# Altium schematic sheet SirenSchematic.SchDoc
size B
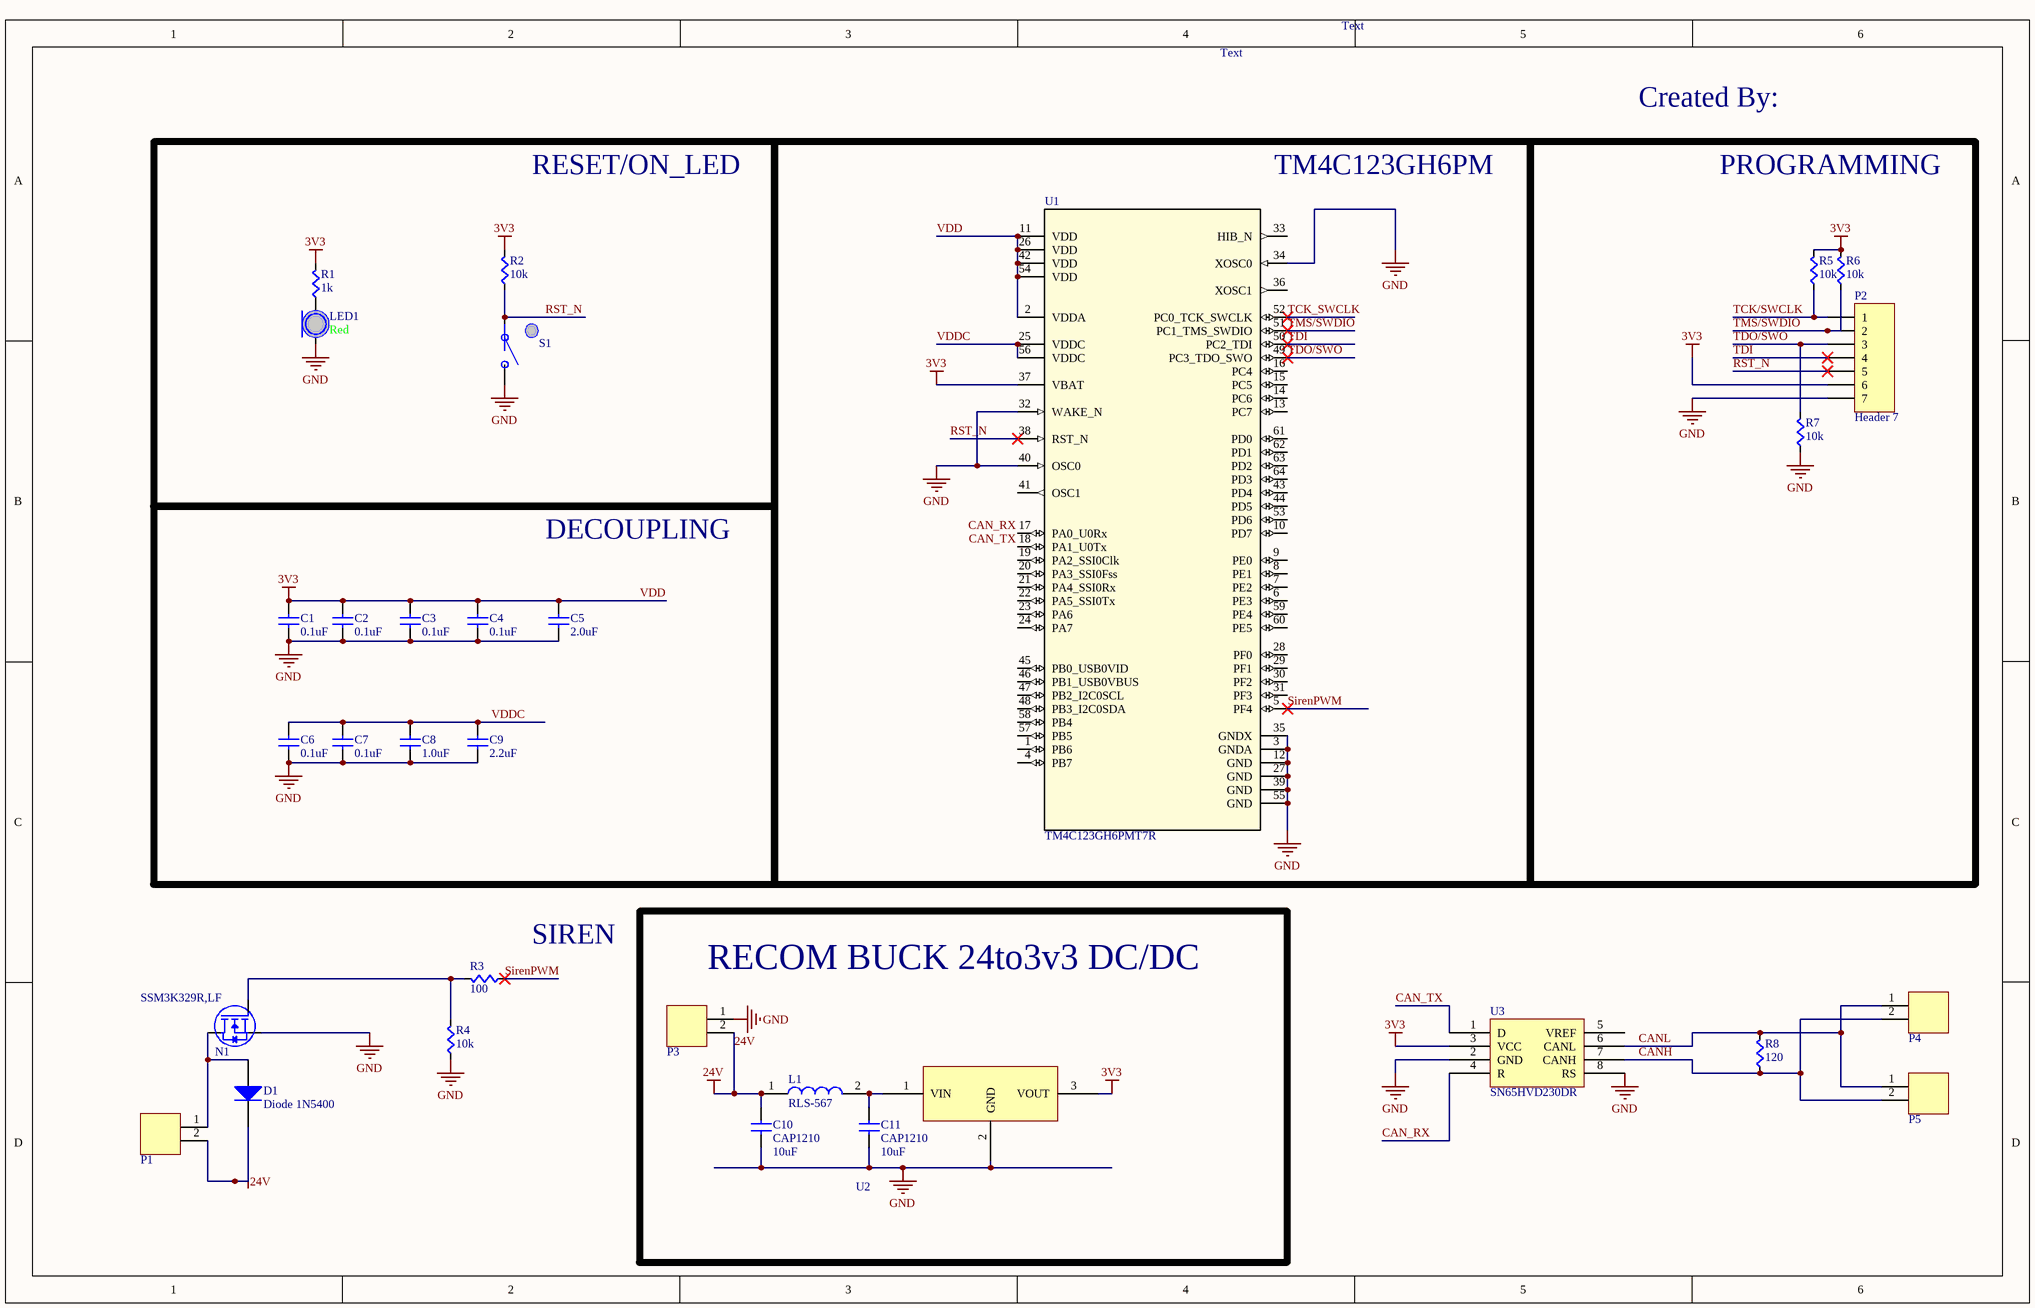
[diagram p0: SirenSchematic.SchDoc]

## Parts
C1  value 0.1uF  [CAPC0603]  (hidden comment: Cap)
C2  value 0.1uF  [CAPC0603]  (hidden comment: Cap)
C3  value 0.1uF  [CAPC0603]  (hidden comment: Cap)
C4  value 0.1uF  [CAPC0603]  (hidden comment: Cap)
C5  value 2.0uF  [CAPC0603]  (hidden comment: Cap)
C6  value 0.1uF  [CAPC0603]  (hidden comment: Cap)
C7  value 0.1uF  [CAPC0603]  (hidden comment: Cap)
C8  value 1.0uF  [CAPC0603]  (hidden comment: Cap)
C9  value 2.2uF  [CAPC0603]  (hidden comment: Cap)
C10  CAP1210  value 10uF  [CAP1210]
C11  CAP1210  value 10uF  [CAP1210]
D1  Diode 1N5400  [DO-201AD]
L1  RLS-567  [*IND_RLS-567]
LED1  Color: Red  [LED0603]  (hidden comment: LED)
N1  SSM3K329R,LF  [SSM3K329R,LF]
P1  2-pin Horz Sherlock  [MOLEX-HDR-1X2-SHERLOCK-HORZ]  (value not drawn)
P2  Header 7  [HDR1X7]
P3  2-pin Horz Sherlock  [MOLEX-HDR-1X2-SHERLOCK-HORZ]  (value not drawn)
P4  2-pin Horz Sherlock  [MOLEX-HDR-1X2-SHERLOCK-HORZ]  (value not drawn)
P5  2-pin Horz Sherlock  [MOLEX-HDR-1X2-SHERLOCK-HORZ]  (value not drawn)
R1  value 1k  [RES0603]  (hidden comment: Res)
R2  value 10k  [RES0603]  (hidden comment: Res)
R3  value 100  [RES0603]  (hidden comment: Res)
R4  value 10k  [RES0603]  (hidden comment: Res)
R5  value 10k  [RES0603]  (hidden comment: Res)
R6  value 10k  [RES0603]  (hidden comment: Res)
R7  value 10k  [RES0603]  (hidden comment: Res)
R8  value 120  [RES0603]  (hidden comment: Res)
S1  Button  [PTS645xxxxSMTR92]  (value not drawn)
U1  TM4C123GH6PMT7R  [PM0064A_N]
U2  R-78C3.3-1.0  [R-78C3.3-1.0]  (value not drawn)
U3  SN65HVD230DR  [SOIC-8pin]

## Blocks framed on the sheet
RESET/ON_LED: LED1 R1 R2 S1
TM4C123GH6PM: U1
PROGRAMMING: P2 R5-R7
DECOUPLING: C1-C9
RECOM BUCK 24to3v3 DC/DC: C10 C11 L1 P3 U2

## Nets
24V: C10.1(A) D1.2(K) L1.1 P1.2 P3.2
GND: C1.2(B) C2.2(B) C3.2(B) C4.2(B) C5.2(B) C6.2(B) C7.2(B) C8.2(B) C9.2(B) C10.2(B) C11.2(B) LED1.C N1.2(S) P2.7 P3.1 R4.2(B) R7.2(B) S1.B U1.3(GNDA) U1.12(GND) U1.27(GND) U1.32(WAKE_N) U1.34(XOSC0) U1.35(GNDX) U1.39(GND) U1.40(OSC0) U1.55(GND) U2.2(GND) U3.2(GND) U3.8(RS)
VDD: C1.1(A) C2.1(A) C3.1(A) C4.1(A) C5.1(A) P2.6 R1.1(A) R2.1(A) R5.1(A) R6.1(A) U1.2(VDDA) U1.11(VDD) U1.26(VDD) U1.37(VBAT) U1.42(VDD) U1.54(VDD) U2.3(VOUT) U3.3(VCC)  [also labelled 3V3]
CAN_RX: U1.17(PA0_U0Rx) U3.4(R)
CAN_TX: U1.18(PA1_U0Tx) U3.1(D)
CANH: P4.2 P5.2 R8.2(B) U3.7(CANH)
CANL: P4.1 P5.1 R8.1(A) U3.6(CANL)
RST_N: P2.5 R2.2(B) S1.A U1.38(RST_N)
SirenPWM: R3.2(B) U1.5(PF4)
TCK/SWCLK: P2.1 R5.2(B)
TCK_SWCLK: U1.52(PC0_TCK_SWCLK)
TDI: P2.4 U1.50(PC2_TDI)
TDO/SWO: P2.3 R7.1(A) U1.49(PC3_TDO_SWO)
TMS/SWDIO: P2.2 R6.2(B) U1.51(PC1_TMS_SWDIO)
VDDC: C6.1(A) C7.1(A) C8.1(A) C9.1(A) U1.25(VDDC) U1.56(VDDC)
NetC11_1: C11.1(A) L1.2 U2.1(VIN)
NetD1_1: D1.1(A) N1.3(D) P1.1
NetLED1_A: LED1.A R1.2(B)
NetN1_1: N1.1(G) R3.1(A) R4.1(A)

Not connected (* = marked no-connect by the designer): U1 1(PB6) 4(PB7) 6(PE3) 7(PE2) 8(PE1) 9(PE0) 10(PD7) 13(PC7) 14(PC6) 15(PC5) 16(PC4) 19(PA2_SSI0Clk) 20(PA3_SSI0Fss) 21(PA4_SSI0Rx) 22(PA5_SSI0Tx) 23(PA6) 24(PA7) 28(PF0) 29(PF1) 30(PF2) 31(PF3) 33(HIB_N) 36(XOSC1) 41(OSC1) 43(PD4) 44(PD5) 45(PB0_USB0VID) 46(PB1_USB0VBUS) 47(PB2_I2C0SCL) 48(PB3_I2C0SDA) 53(PD6) 57(PB5) 58(PB4) 59(PE4) 60(PE5) 61(PD0) 62(PD1) 63(PD2) 64(PD3); U3 5(VREF)

## Notes on the sheet
- Text
- Created By:
- (near R3) SIREN

## Library data of the parts
C10 C11 = CAP1210: CAP CER 10UF 50V 20% X5R 1210; Supplier 1: Digi-Key; Supplier Part Number 1: 587-2225-1-ND
D1 = Diode 1N5400: 3 Amp General Purpose Rectifier; Published: 8-Jun-2000; LatestRevisionDate: 17-Jul-2002; LatestRevisionNote: Re-released for DXP Platform.; DatasheetVersion: 1998; PackageVersion: Aug-1999; PackageReference: DO-201AD; Publisher: Altium Limited; PackageDescription: Diode, Axial; Body 9.5 x 5.6 mm (LxDia. max), Lead Dia. 1.32 mm (max); ComponentLink1Description: Manufacturer Link; ComponentLink1URL: http://www.fairchildsemi.com/; ComponentLink2Description: Datasheet; ComponentLink2URL: http://www.fairchildsemi.com/ds/1N%2F1N5400.pdf
L1 = RLS-567: Inductor; Manufacturer_Name: RECOM Power; Datasheet Link: https://componentsearchengine.com/Datasheets/1/RLS-567.pdf; Height: 3.1mm; Mouser Part Number: 919-RLS-567; Mouser Price/Stock: https://www.mouser.com/Search/Refine.aspx?Keyword=919-RLS-567; Manufacturer_Part_Number: RLS-567
N1 = SSM3K329R,LF: MOSFET N CH 30V 3.5A 2-3Z1A; Manufacturer 1: Toshiba Semiconductor and Storage; Supplier 1: Digi-Key; Supplier Part Number 1: SSM3K329RLFTR-ND; Manufacturer Part Number 1: SSM3K329R,LF
P1 P3-P5 = MOLEX-HDR-1x2-SHERLOCK_RA: Header, Molex, 2mm Pitch Sherlock Header, Single Row, Horizontal, 2 Circuits, Length 3.3mm,  0353630260; Manufacturer: Molex Inc; Manufacturer Part Number: 0353630260; Supplier Part Number 1: WM18931-ND; Supplier 1: Digi-Key
P2 = Header 7: Header, 7-Pin; LatestRevisionDate: 17-Jul-2002; LatestRevisionNote: Re-released for DXP Platform.; Publisher: Altium Limited
S1 = Button: SPST Button; Supplier 1: Digi-Key; Supplier Part Number 1: CKN9087CT-ND
U1 = TM4C123GH6PMT7R: Imported; PartNumber: TM4C123GH6PMTR; Manufacturer: Texas Instruments; CompType: IC; PIN_COUNT: 64; Application_BuildNumber: *; Alternate_PartNumber: TM4C123GH6PMT; PackageReference: PM0064A; MountType: SMT; RoHS: Y; RefDes: RefDes; TYPE: TYPE; Value: Value
U2 = R-78C3.3-1.0: CONV DC/DC 1A 3.3V OUT SIP VERT; Supplier 1: Digi-Key; Supplier Part Number 1: 945-1394-5-ND
U3 = SN65HVD230DR: IC TXRX CAN 1MBPS 3.3V 8SOIC; Supplier 1: Digi-Key; Supplier Part Numbe 1: 296-11654-1-ND
C1-C9 = Cap: Supplier 1: Digi-Key; Supplier Part Number 1: 1276-1000-1-ND
LED1 = LED: Supplier 1: Digi-Key; Supplier Part Number 1: 754-1122-1-ND
R1-R8 = Res: Supplier 1: Digi-Key; Supplier Part Number 1: RMCF0603JT10K0CT-ND